# Altium schematic sheet SoC_FPGA_HD_84_87.SchDoc: RFSoC AMC
size 420 x 297 mm; CompanyName: WUT; DrawnBy: T. Przywozki; Organization: WUT ISE; Address1: Warsaw University of Technology; Address2: Nowowiejska 15/19 00-665 Warsaw; Address3: Tomasz.Przywozki@pw.edu.pl; DocumentNumber: 5; Revision: 1; SheetNumber: 5; SheetTotal: 45; Project: RFSoC AMC; ModifiedBy: T. Przywozki; CreateDate: -; CheckedDate: -; DivGrp: ISE; Designer: T. Przywozki; ModifiedDate: -; ProjectName: ADC/DAC MEZZANINE
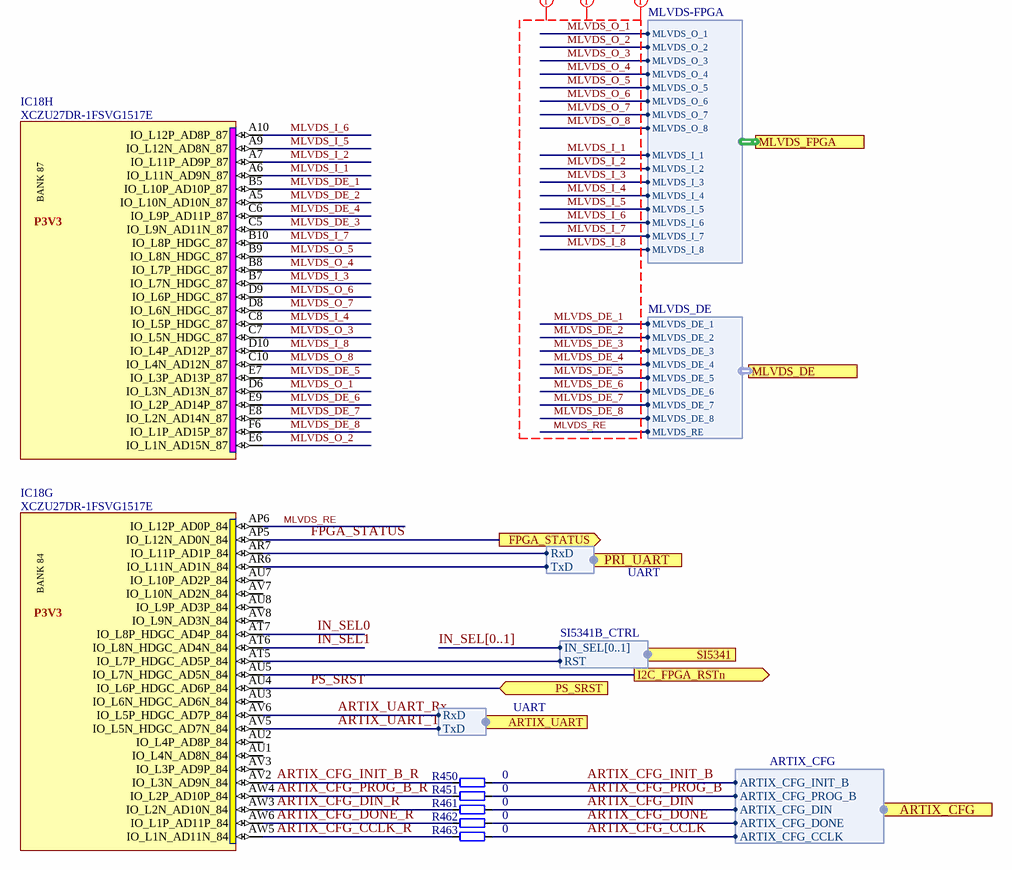
[diagram p0: SoC_FPGA_HD_84_87.SchDoc]

## Parts
IC18  XCZU27DR-1FSVG1517E  [XILINX_FSVG1517 (XCZU27DR)]  (parts G,H of 31)
R450  0  [RESC1005X40N]
R451  0  [RESC1005X40N]
R461  0  [RESC1005X40N]
R462  0  [RESC1005X40N]
R463  0  [RESC1005X40N]

## Ports
ARTIX_CFG (harness ARTIX_CFG), ARTIX_UART (harness UART), FPGA_STATUS (out), I2C_FPGA_RSTn (out), MLVDS_DE (harness MLVDS_DE), MLVDS_FPGA (harness MLVDS-FPGA), PRI_UART (harness UART), PS_SRST (in), SI5341 (harness SI5341B_CTRL)

## Harnesses
ARTIX_CFG: ARTIX_CFG_DIN, ARTIX_CFG_CCLK, ARTIX_CFG_PROG_B, ARTIX_CFG_DONE, ARTIX_CFG_INIT_B
UART: RxD, TxD
SI5341B_CTRL: IN_SEL[0..1], RST
MLVDS-FPGA: MLVDS_O_1, MLVDS_O_2, MLVDS_O_3, MLVDS_O_4, MLVDS_O_5, MLVDS_O_6, MLVDS_O_7, MLVDS_O_8, MLVDS_I_1, MLVDS_I_2, MLVDS_I_3, MLVDS_I_4, MLVDS_I_5, MLVDS_I_6, MLVDS_I_7, MLVDS_I_8
MLVDS_DE: MLVDS_DE_1, MLVDS_DE_2, MLVDS_DE_3, MLVDS_DE_4, MLVDS_DE_5, MLVDS_DE_6, MLVDS_DE_7, MLVDS_DE_8, MLVDS_RE

## Nets
ARTIX_CFG_CCLK: R463.2 ; port ARTIX_CFG.ARTIX_CFG_CCLK
ARTIX_CFG_CCLK_R: IC18.AW5(IO_L1N_AD11N_84) R463.1
ARTIX_CFG_DIN: R461.2 ; port ARTIX_CFG.ARTIX_CFG_DIN
ARTIX_CFG_DIN_R: IC18.AW3(IO_L2N_AD10N_84) R461.1
ARTIX_CFG_DONE: R462.2 ; port ARTIX_CFG.ARTIX_CFG_DONE
ARTIX_CFG_DONE_R: IC18.AW6(IO_L1P_AD11P_84) R462.1
ARTIX_CFG_INIT_B: R450.2 ; port ARTIX_CFG.ARTIX_CFG_INIT_B
ARTIX_CFG_INIT_B_R: IC18.AV2(IO_L3N_AD9N_84) R450.1
ARTIX_CFG_PROG_B: R451.2 ; port ARTIX_CFG.ARTIX_CFG_PROG_B
ARTIX_CFG_PROG_B_R: IC18.AW4(IO_L2P_AD10P_84) R451.1
ARTIX_UART_Rx: IC18.AV6(IO_L5P_HDGC_AD7P_84) ; port ARTIX_UART.RxD
ARTIX_UART_Tx: IC18.AV5(IO_L5N_HDGC_AD7N_84) ; port ARTIX_UART.TxD
FPGA_STATUS: IC18.AP5(IO_L12N_AD0N_84) ; port FPGA_STATUS
I2C_FPGA_RSTn: IC18.AU5(IO_L7N_HDGC_AD5N_84) ; port I2C_FPGA_RSTn
IN_SEL0: IC18.AT7(IO_L8P_HDGC_AD4P_84)
IN_SEL1: IC18.AT6(IO_L8N_HDGC_AD4N_84)
MLVDS_DE_1: IC18.B5(IO_L10P_AD10P_87) ; port MLVDS_DE.MLVDS_DE_1
MLVDS_DE_2: IC18.A5(IO_L10N_AD10N_87) ; port MLVDS_DE.MLVDS_DE_2
MLVDS_DE_3: IC18.C5(IO_L9N_AD11N_87) ; port MLVDS_DE.MLVDS_DE_3
MLVDS_DE_4: IC18.C6(IO_L9P_AD11P_87) ; port MLVDS_DE.MLVDS_DE_4
MLVDS_DE_5: IC18.E7(IO_L3P_AD13P_87) ; port MLVDS_DE.MLVDS_DE_5
MLVDS_DE_6: IC18.E9(IO_L2P_AD14P_87) ; port MLVDS_DE.MLVDS_DE_6
MLVDS_DE_7: IC18.E8(IO_L2N_AD14N_87) ; port MLVDS_DE.MLVDS_DE_7
MLVDS_DE_8: IC18.F6(IO_L1P_AD15P_87) ; port MLVDS_DE.MLVDS_DE_8
MLVDS_I_1: IC18.A6(IO_L11N_AD9N_87) ; port MLVDS_FPGA.MLVDS_I_1
MLVDS_I_2: IC18.A7(IO_L11P_AD9P_87) ; port MLVDS_FPGA.MLVDS_I_2
MLVDS_I_3: IC18.B7(IO_L7N_HDGC_87) ; port MLVDS_FPGA.MLVDS_I_3
MLVDS_I_4: IC18.C8(IO_L5P_HDGC_87) ; port MLVDS_FPGA.MLVDS_I_4
MLVDS_I_5: IC18.A9(IO_L12N_AD8N_87) ; port MLVDS_FPGA.MLVDS_I_5
MLVDS_I_6: IC18.A10(IO_L12P_AD8P_87) ; port MLVDS_FPGA.MLVDS_I_6
MLVDS_I_7: IC18.B10(IO_L8P_HDGC_87) ; port MLVDS_FPGA.MLVDS_I_7
MLVDS_I_8: IC18.D10(IO_L4P_AD12P_87) ; port MLVDS_FPGA.MLVDS_I_8
MLVDS_O_1: IC18.D6(IO_L3N_AD13N_87) ; port MLVDS_FPGA.MLVDS_O_1
MLVDS_O_2: IC18.E6(IO_L1N_AD15N_87) ; port MLVDS_FPGA.MLVDS_O_2
MLVDS_O_3: IC18.C7(IO_L5N_HDGC_87) ; port MLVDS_FPGA.MLVDS_O_3
MLVDS_O_4: IC18.B8(IO_L7P_HDGC_87) ; port MLVDS_FPGA.MLVDS_O_4
MLVDS_O_5: IC18.B9(IO_L8N_HDGC_87) ; port MLVDS_FPGA.MLVDS_O_5
MLVDS_O_6: IC18.D9(IO_L6P_HDGC_87) ; port MLVDS_FPGA.MLVDS_O_6
MLVDS_O_7: IC18.D8(IO_L6N_HDGC_87) ; port MLVDS_FPGA.MLVDS_O_7
MLVDS_O_8: IC18.C10(IO_L4N_AD12N_87) ; port MLVDS_FPGA.MLVDS_O_8
MLVDS_RE: IC18.AP6(IO_L12P_AD0P_84) ; port MLVDS_DE.MLVDS_RE
PS_SRST: IC18.AU4(IO_L6P_HDGC_AD6P_84) ; port PS_SRST
NetIC18_AR6: IC18.AR6(IO_L11N_AD1N_84) ; port PRI_UART.TxD
NetIC18_AR7: IC18.AR7(IO_L11P_AD1P_84) ; port PRI_UART.RxD
NetIC18_AT5: IC18.AT5(IO_L7P_HDGC_AD5P_84) ; port SI5341.RST

Not connected (* = marked no-connect by the designer): IC18 AU1(IO_L4N_AD8N_84) AU2(IO_L4P_AD8P_84) AU3(IO_L6N_HDGC_AD6N_84) AU7(IO_L10P_AD2P_84) AU8(IO_L9P_AD3P_84) AV3(IO_L3P_AD9P_84) AV7(IO_L10N_AD2N_84) AV8(IO_L9N_AD3N_84)

## Buses and harness runs
bus IN_SEL[0..1]

## Layout directives
net class MLVDS_F: MLVDS_DE_1, MLVDS_DE_2, MLVDS_DE_3, MLVDS_DE_4, MLVDS_DE_5, MLVDS_DE_6, MLVDS_DE_7, MLVDS_DE_8, MLVDS_I_1, MLVDS_I_2, MLVDS_I_3, MLVDS_I_4, MLVDS_I_5, MLVDS_I_6, MLVDS_I_7, MLVDS_I_8, MLVDS_O_1, MLVDS_O_2, MLVDS_O_3, MLVDS_O_4, MLVDS_O_5, MLVDS_O_6, MLVDS_O_7, MLVDS_O_8, MLVDS_RE
net class SE50: MLVDS_DE_1, MLVDS_DE_2, MLVDS_DE_3, MLVDS_DE_4, MLVDS_DE_5, MLVDS_DE_6, MLVDS_DE_7, MLVDS_DE_8, MLVDS_I_1, MLVDS_I_2, MLVDS_I_3, MLVDS_I_4, MLVDS_I_5, MLVDS_I_6, MLVDS_I_7, MLVDS_I_8, MLVDS_O_1, MLVDS_O_2, MLVDS_O_3, MLVDS_O_4, MLVDS_O_5, MLVDS_O_6, MLVDS_O_7, MLVDS_O_8, MLVDS_RE
net class SE_SIG: MLVDS_DE_1, MLVDS_DE_2, MLVDS_DE_3, MLVDS_DE_4, MLVDS_DE_5, MLVDS_DE_6, MLVDS_DE_7, MLVDS_DE_8, MLVDS_I_1, MLVDS_I_2, MLVDS_I_3, MLVDS_I_4, MLVDS_I_5, MLVDS_I_6, MLVDS_I_7, MLVDS_I_8, MLVDS_O_1, MLVDS_O_2, MLVDS_O_3, MLVDS_O_4, MLVDS_O_5, MLVDS_O_6, MLVDS_O_7, MLVDS_O_8, MLVDS_RE

## Notes on the sheet
- P3V3
- Project/Equipment
- Document
- Designer
- Drawn by
- Check.by
- Copyright WUT ISE 2021
  This documentation describes Open Hardware and is licensed under CERN OHL v.1.1. You may redistribute and modify this documentaction under the terms of the CERN OHL v1.1.
  (http://ohwr.org/CERNOHL). This documentation is dristributed WITHOUT ANY EXPRESS OR IMPLIED WARRANTY, INCLUDING OF MERCHANTABLITY, SATISFACTORY QUALITY AND FITNESS FOR A PARTICULAR PURPOSE. Please see the CERN OHL v.1.1 for applicable conditions
- File
- Last Mod.
- Print Date
- Sheet
- Size
- A3
- of
- Rev
- Contact:
- (in symbol XCZU27DR-1FSVG1517E, part G) BANK 84
- (in symbol XCZU27DR-1FSVG1517E, part H) BANK 87

## Library data of the parts
IC18 = XCZU27DR-1FSVG1517E: Zynq UltraScale+ RFSoC, Quad-Core ARM® Cortex™-A53 MPCore™ up to 1.5GHz, 214 PS I/O, 299 HP I/O, 48 HD I/O, 1517-Pin BGA; Manufacturer: XILINX; PressFit: No; Bonding: No; Part Number: XCZU27DR-1FSVG1517E; Component Kind: Standard; Component Type: Standard; Device: XCZU27DR-1FSVG1517E; PackageDescription: BGA, 1.00mm Pitch, Square; 1517 Pin, 39 Columns X 39 Rows, 40.00mm X 40.00mm X 4.01mm H; Part Description: Zynq UltraScale+ RFSoC, Quad-Core ARM® Cortex™-A53 MPCore™ up to 1.5GHz, 214 PS I/O, 299 HP I/O, 48 HD I/O, 1517-Pin BGA; Manufacturer Part Number: XCZU27DR-1FSVG1517E; Pin Count: 1517; Case: BGA1517; Mounted: Yes; Socket: No; SMD: Yes; Sense: No; ComponentHeight: 4.01mm; HelpURL: \\cern.ch\dfs\Applications\Altium\Datasheets\XCZU27DR-1FSVG1517E.pdf; ComponentLink1URL: \\cern.ch\dfs\Applications\Altium\Datasheets\XCZU27DR-1FSVG1517E_Package-Pinout.pdf; ComponentLink1Description: Package/Pinout; ComponentLink2URL: \\cern.ch\dfs\Applications\Altium\Datasheets\XCZU27DR-1FSVG1517E_Pinout.pdf; ComponentLink2Description: Pinout; Author: CERN DEM MR; CreateDate: 02/05/2018; LatestRevisionDate: 02/05/2018
R450 R451 R461-R463 = R0402_0R_JUMPER: Resistor; Manufacturer: GENERIC; Part Description: 1A (0.05R Max DC Resistance) Zero Ohm Jumper; Manufacturer1 Part Number: 232270591001L; PressFit: No; Manufacturer Part Number: R0402_0R_JUMPER; Part Number: R0402_0R_JUMPER; Value: 0; Component Kind: Standard; Component Type: Standard; Pin Count: 2; Status: Not Recommended; Case: 0402; Mounted: Yes; Sense: No; Socket: No; SMD: Yes; Manufacturer1 Example: YAGEO PHYCOMP; Manufacturer1 ComponentHeight: 0.4mm; HelpURL: \\cern.ch\dfs\Applications\Altium\Datasheets\R0402_Phycomp_RC0402.pdf; Author: CERN DEM JLC; CreateDate: 03.12.2007; LatestRevisionDate: 17.10.2012